# EAGLE design PWB, A2530 BOOSTERPACK (EAGLE 6.2)

## Sheet 1 of 2
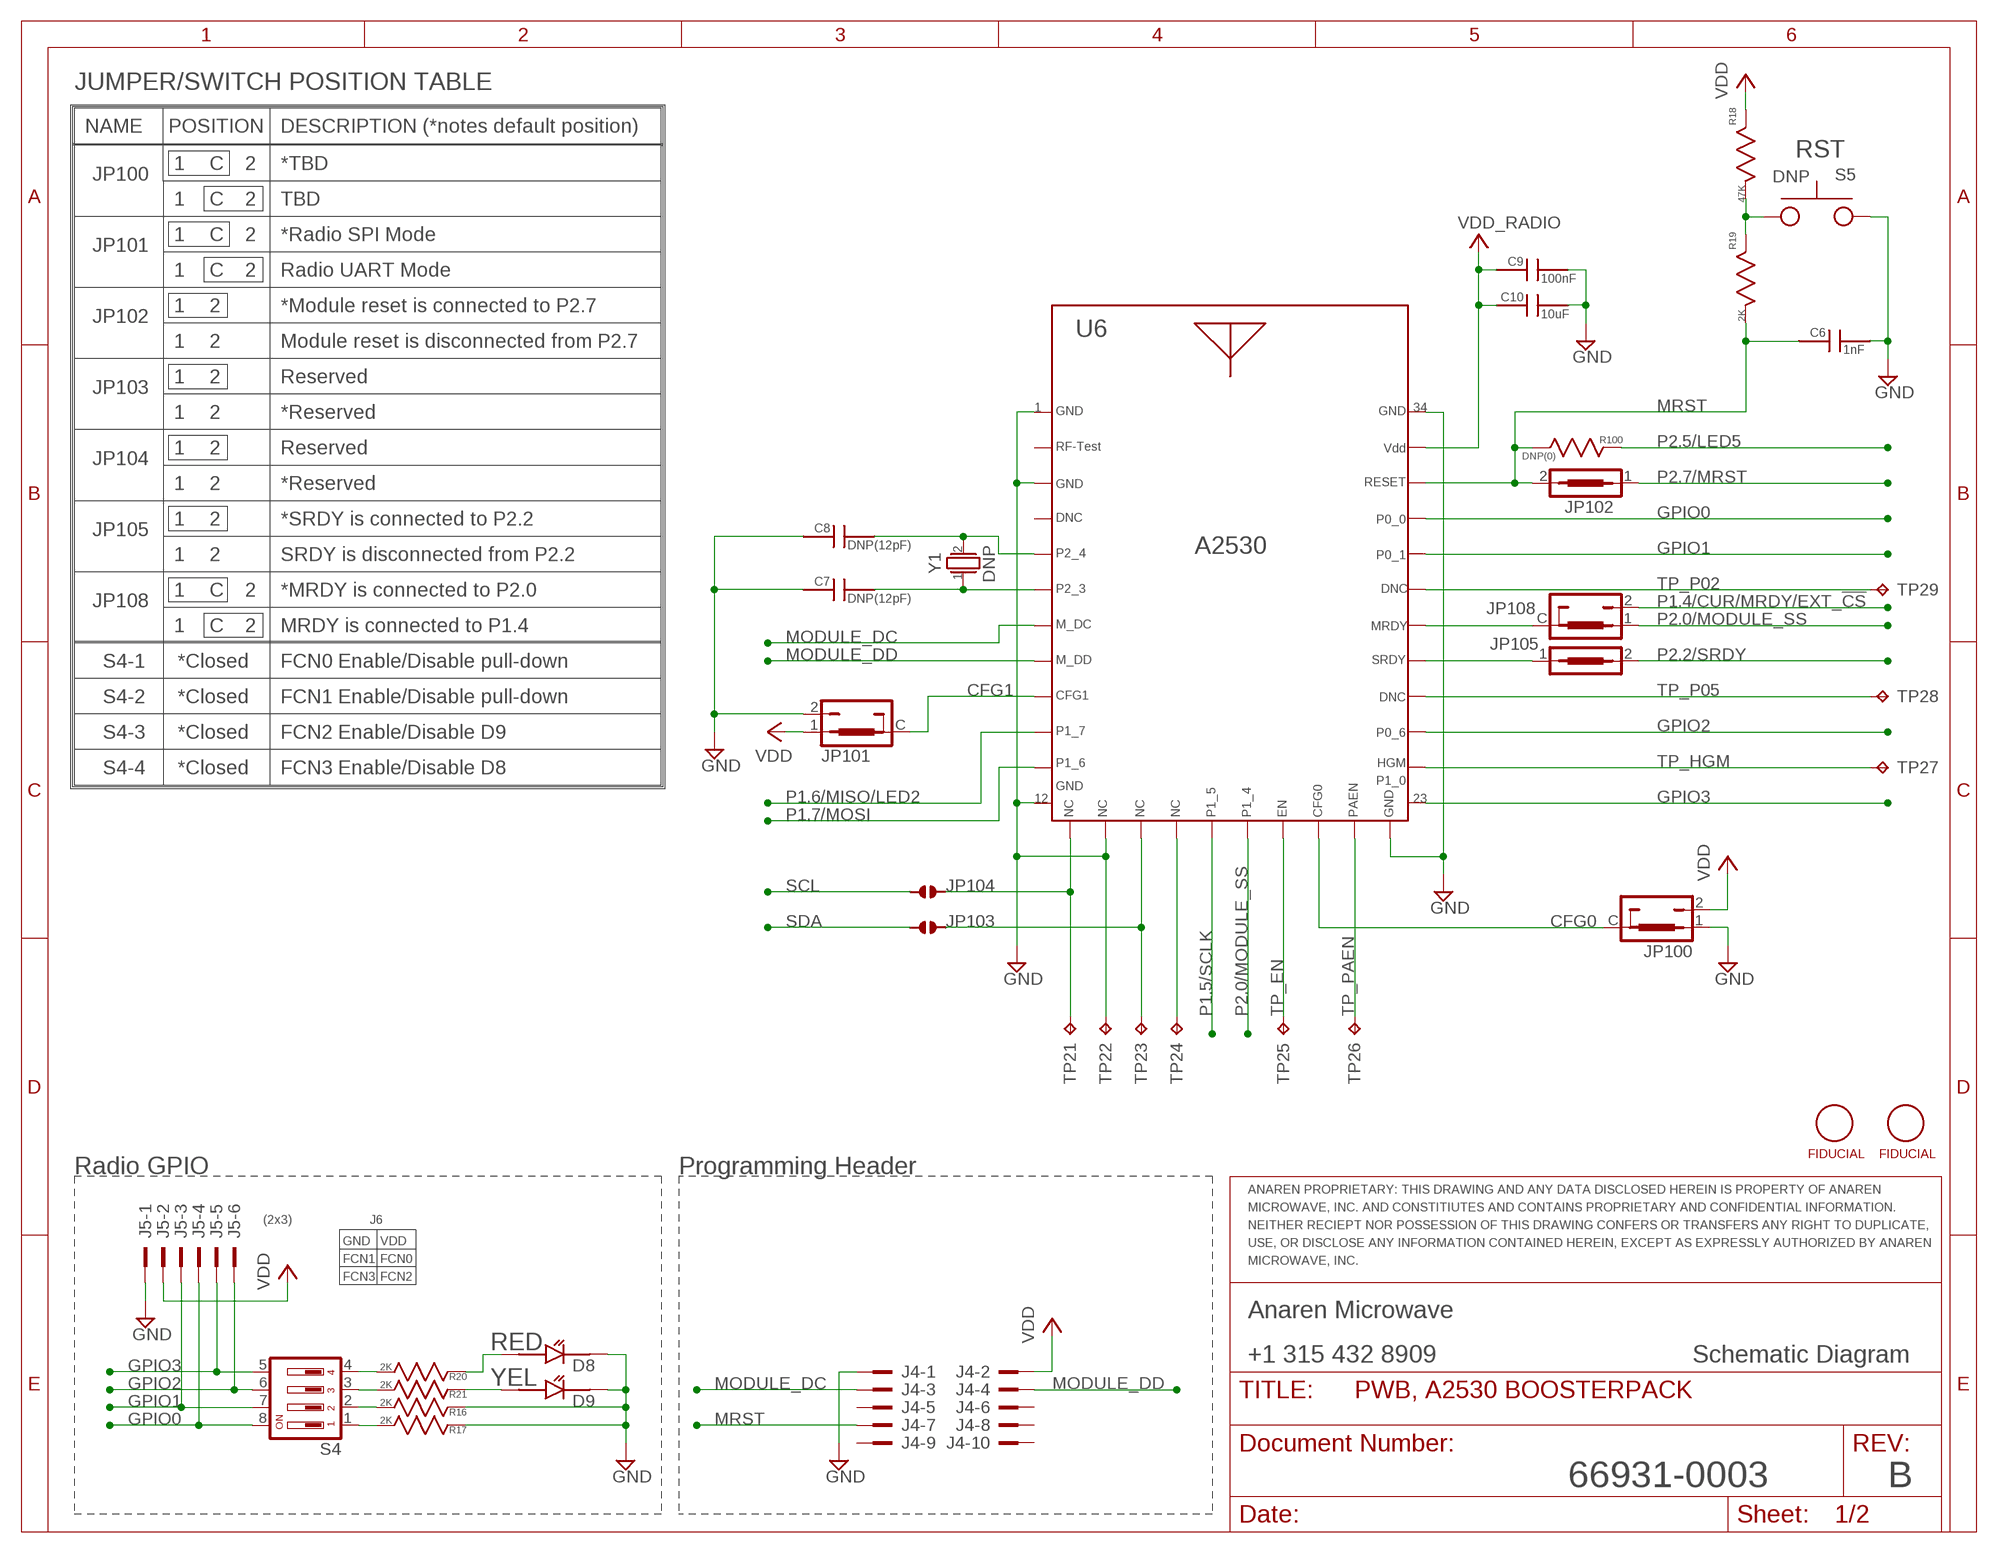
[diagram p0: schematic, sheet 1]

### Parts
C6  1nF  CAP_SMT0402  [0402CAP]
C7  DNP(12pF)  CAP_SMT0402  [0402CAP]
C8  DNP(12pF)  CAP_SMT0402  [0402CAP]
C9  100nF  CAP_SMT0402  [0402CAP]
C10  10uF  CAP_SMT0402  [0402CAP]
D8  LED_SMT_0402  [0402_LED]
D9  LED_SMT_0402  [0402_LED]
J4  SAMTEC_SHF-105-01-L-D-TH_NO_SHROUD  [SAMTEC_SHF-105-01-L-D-TH_NO_SHROUD]
J5  PROTO_100MIL_2X3  [PROTO_100MIL_2X3]
JP100  JP0603_2C_A  [JP0603_2C_A]
JP101  JP0603_2C_A  [JP0603_2C_A]
JP102  JP0603_1P_A  [JP0603_1P_A]
JP103  SOLDER_JUMPER_16MIL  [SOLDER_JUMP_16MIL]
JP104  SOLDER_JUMPER_16MIL  [SOLDER_JUMP_16MIL]
JP105  JP0603_1P_A  [JP0603_1P_A]
JP108  JP0603_2C_A  [JP0603_2C_A]
R16  2K  R0402  [RESC1005X40N]
R17  2K  R0402  [RESC1005X40N]
R18  47K  R0402  [RESC1005X40N]
R19  2K  R0402  [RESC1005X40N]
R20  2K  R0402  [RESC1005X40N]
R21  2K  R0402  [RESC1005X40N]
R100  DNP(0)  0603RES  [0603_COMPONENT]
S4  DIP_SWITCH_218-4LPSTJ  [DIP_SWITCH_218-4LPSTJ]
S5  DNP  SWITCH_B3U-1000P  [SWITCH_B3U-1000P]
TP21  TP_TH_20MIL_R  [TP_TH_20MIL_R]
TP22  TP_TH_20MIL_R  [TP_TH_20MIL_R]
TP23  TP_TH_20MIL_R  [TP_TH_20MIL_R]
TP24  TP_TH_20MIL_R  [TP_TH_20MIL_R]
TP25  TP_TH_20MIL_R  [TP_TH_20MIL_R]
TP26  TP_TH_20MIL_R  [TP_TH_20MIL_R]
TP27  TP_TH_20MIL_R  [TP_TH_20MIL_R]
TP28  TP_TH_20MIL_R  [TP_TH_20MIL_R]
TP29  TP_TH_20MIL_R  [TP_TH_20MIL_R]
U6  CC2530  [CC2530]
U$1  FIDUCIAL0.5MM  [FIDUCIAL_0.5MM]
U$13  FIDUCIAL0.5MM  [FIDUCIAL_0.5MM]
Y1  DNP  ABRACON_ABS06  [ABRACON_ABS06]

### Nets
CFG0: JP100.C U6.20_GIO2
CFG1: JP101.C U6.9_GIO13
GND [GND]: C6.P$2 C7.P$1 C8.P$1 C9.P$2 C10.P$2 D8.2 D9.2 J4.1 J5.1 JP100.1 JP101.2 R16.1 R17.1 S5.2 TP22.P$1(TP) U6.1_GND U6.3_GND U6.12_GND U6.14_USBP U6.22_GND U6.34_GND ; also sheet 2
GPIO0: J5.4 S4.8 U6.31_HGM
GPIO1: J5.3 S4.7 U6.30_GND
GPIO2: J5.6 S4.6 U6.25_BCLK
GPIO3: J5.5 S4.5 U6.23_RSTN
MODULE_DC: J4.3 U6.7_SDA
MODULE_DD: J4.4 U6.8_GIO12
MRDY: JP108.C U6.28_AD1
MRST: C6.P$1 J4.7 JP102.2 R19.2 R100.1 U6.32_IOVDD ; also sheet 2
N$1: R20.2 S4.4
N$2: R21.2 S4.3
N$3: R16.2 S4.2
N$4: R17.2 S4.1
N$5: C7.P$2 U6.6_SCL Y1.1
N$14: D9.1 R21.1
N$15: D8.1 R20.1
N$16: JP104.P2 TP21.P$1(TP) U6.13_USBM
N$17: JP103.P2 TP23.P$1(TP) U6.15_CSN
N$18: R18.2 R19.1 S5.1
N$40: TP24.P$1(TP) U6.16_SCLK
P1.4/CUR/MRDY/EXT_!CS: JP108.2 ; also sheet 2
P1.5/SCLK: U6.17_MOSI ; also sheet 2
P1.6/MISO/LED2: U6.10_PA ; also sheet 2
P1.6/MISO/SCL/LED1: C8.P$2 U6.5_VBAT Y1.2
P1.7/MOSI: U6.11_LNA ; also sheet 2
P2.0/MODULE_SS: JP108.1 U6.18_MISO ; also sheet 2
P2.2/SRDY: JP105.2 ; also sheet 2
P2.5/LED5: R100.2 ; also sheet 2
P2.7/MRST: JP102.1 ; also sheet 2
SCL: JP104.P1 ; also sheet 2
SDA: JP103.P1 ; also sheet 2
SRDY: JP105.1 U6.27_AD0 ; also sheet 2
TP_EN: TP25.P$1(TP) U6.19_GIO1
TP_HGM: TP27.P$1(TP) U6.24_MCLK
TP_P02: TP29.P$1(TP) U6.29_GIO9/AD2
TP_P05: TP28.P$1(TP) U6.26_WCLK
TP_PAEN: TP26.P$1(TP) U6.21_GIO3
VDD [PWR]: J4.2 J5.2 JP100.2 JP101.1 R18.1 ; also sheet 2
VDD_RADIO: C9.P$1 C10.P$1 U6.33_VDD ; also sheet 2
Unconnected: J4.5 J4.6 J4.8 J4.9 J4.10 U6.2_RF_TEST U6.4_DNC

### Notes on the sheet
- JUMPER/SWITCH POSITION TABLE
- NAME | POSITION | DESCRIPTION (*notes default position)
- RST
- 1 | C | 2 | *TBD
- JP100
- 1 | C | 2 | TBD
- 1 | C | 2 | *Radio SPI Mode
- JP101
- 1 | C | 2 | Radio UART Mode
- 1 | 2 | *Module reset is connected to P2.7
- JP102
- 1 | 2 | Module reset is disconnected from P2.7
- 1 | 2 | Reserved
- JP103
- 1 | 34
- 1 | 2 | *Reserved
- 1 | 2 | Reserved
- JP104
- 1 | 2 | *Reserved
- 1 | 2 | *SRDY is connected to P2.2
- JP105
- A2530
- 1 | 2 | SRDY is disconnected from P2.2
- 1 | C | 2 | *MRDY is connected to P2.0
- JP108
- 1 | C | 2 | MRDY is connected to P1.4
- S4-1 | *Closed | FCN0 Enable/Disable pull-down
- S4-2 | *Closed | FCN1 Enable/Disable pull-down
- S4-3 | *Closed | FCN2 Enable/Disable D9
- S4-4 | *Closed | FCN3 Enable/Disable D8
- 12 | 23
- Radio GPIO | Programming Header
- ANAREN PROPRIETARY: THIS DRAWING AND ANY DATA DISCLOSED HEREIN IS PROPERTY OF ANAREN
- MICROWAVE, INC. AND CONSTITIUTES AND CONTAINS PROPRIETARY AND CONFIDENTIAL INFORMATION.
- (2x3) | J6
- NEITHER RECIEPT NOR POSSESSION OF THIS DRAWING CONFERS OR TRANSFERS ANY RIGHT TO DUPLICATE,
- GND | VDD | USE, OR DISCLOSE ANY INFORMATION CONTAINED HEREIN, EXCEPT AS EXPRESSLY AUTHORIZED BY ANAREN
- FCN1 | FCN0 | MICROWAVE, INC.
- FCN3 | FCN2
- Anaren Microwave
- RED
- +1 315 432 8909 | Schematic Diagram
- YEL
- 66931-0003 | B

## Sheet 2 of 2
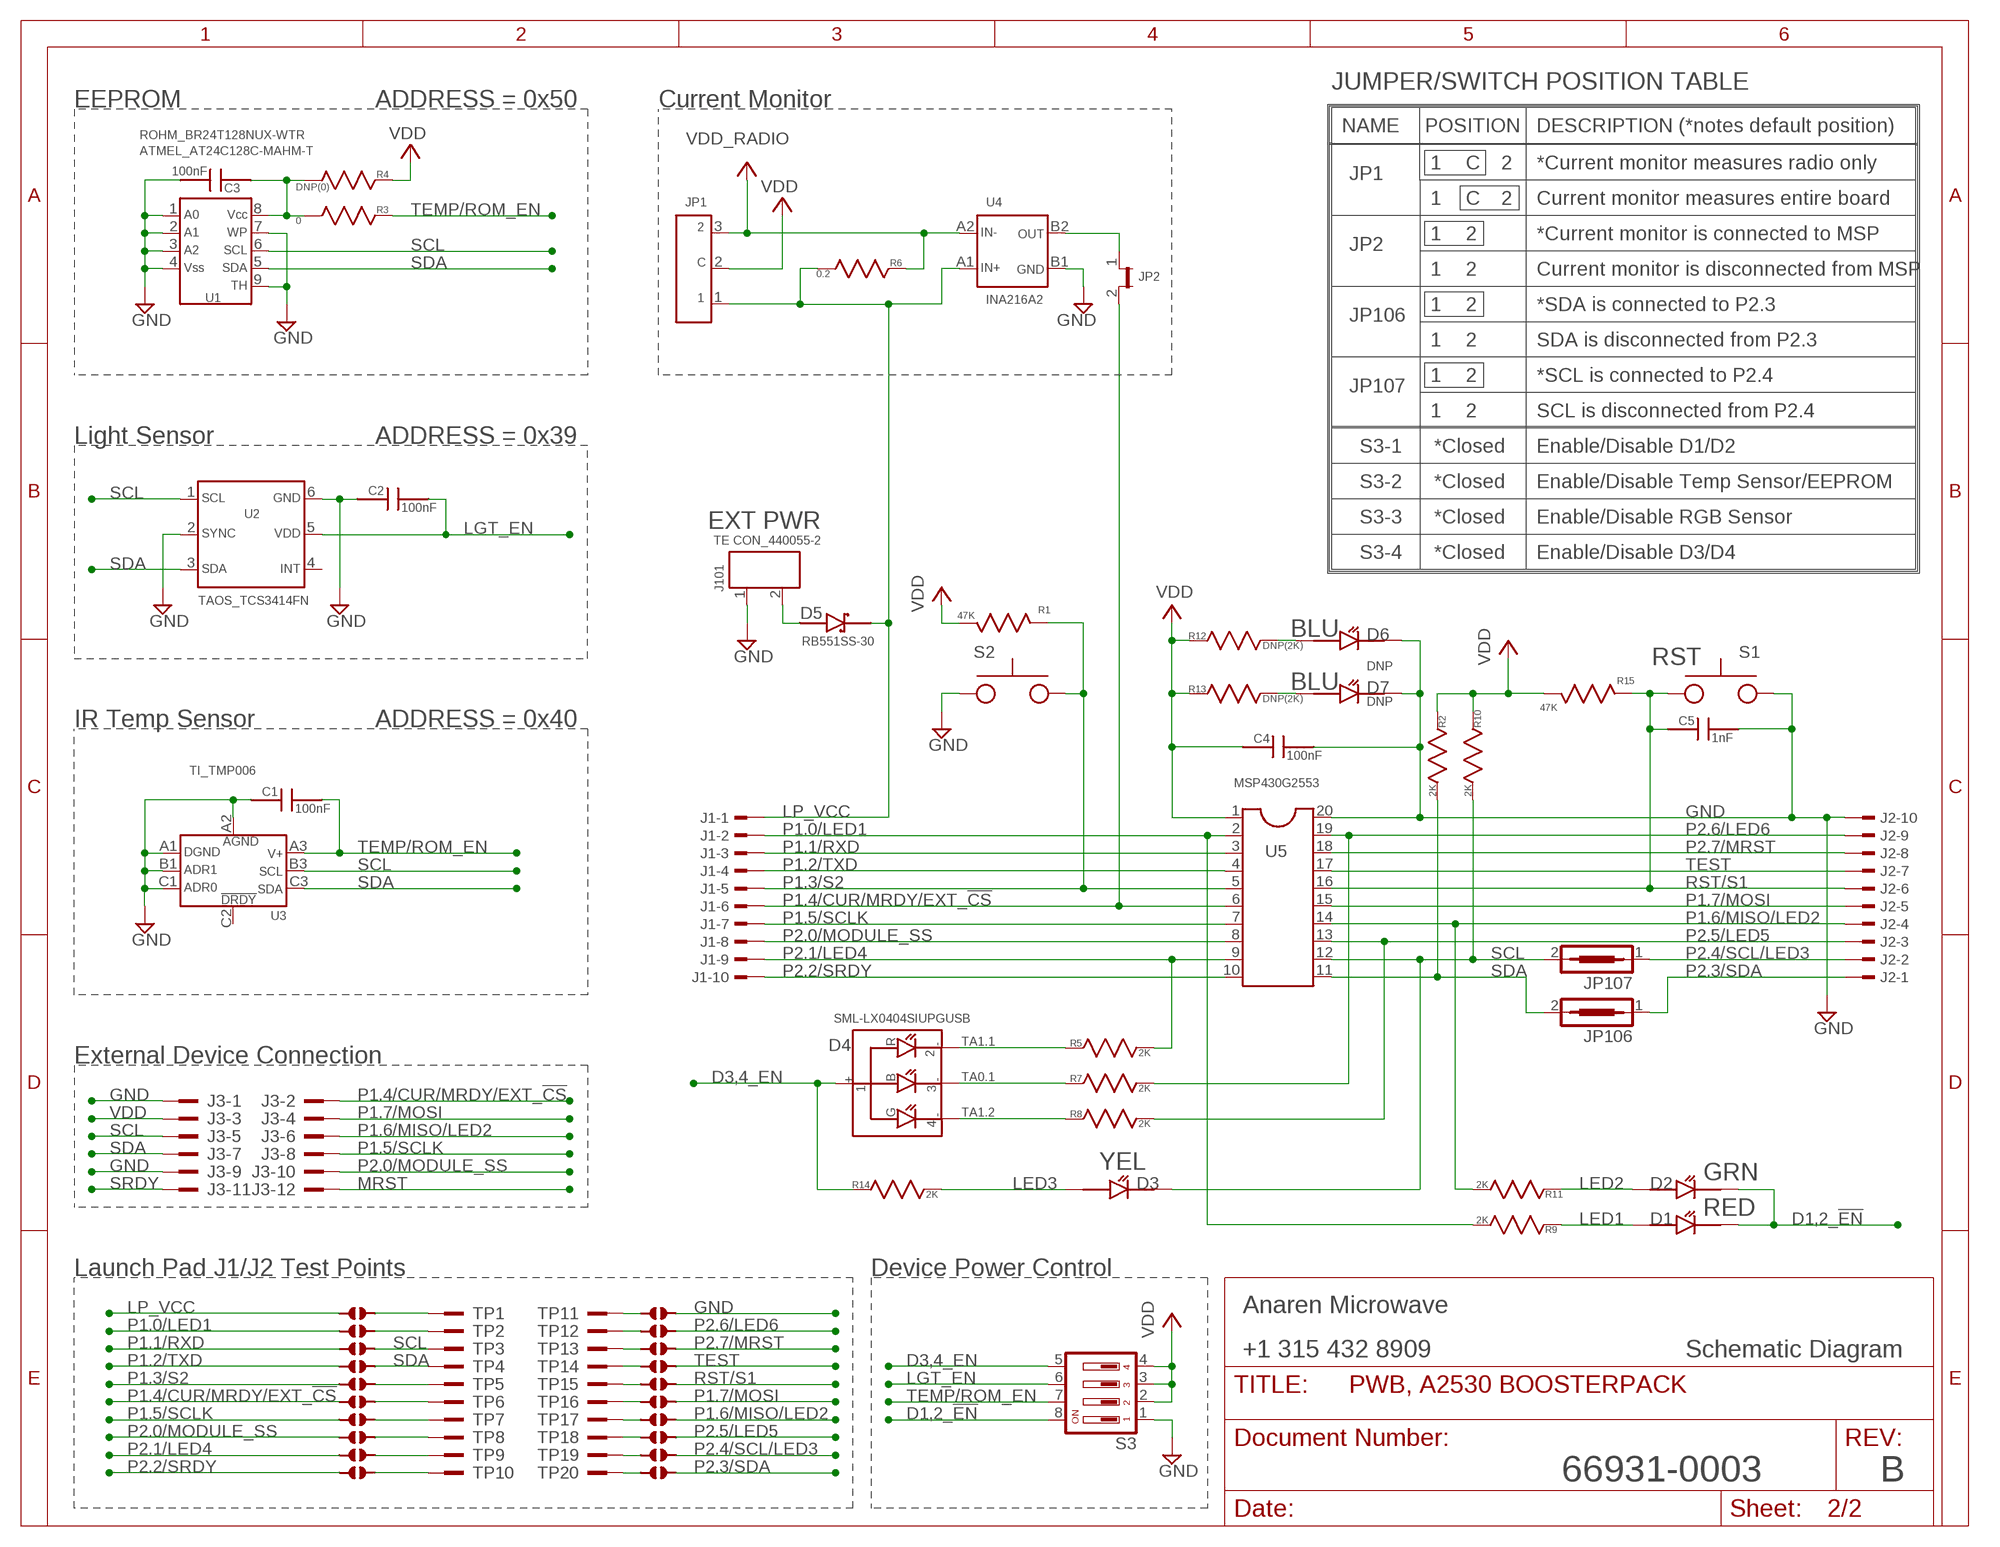
[diagram p1: schematic, sheet 2]

### Parts
C1  100nF  CAP_SMT0402  [0402CAP]
C2  100nF  CAP_SMT0402  [0402CAP]
C3  100nF  CAP_SMT0402  [0402CAP]
C4  100nF  CAP_SMT0402  [0402CAP]
C5  1nF  CAP_SMT0402  [0402CAP]
D1  LED_SMT_0402  [0402_LED]
D2  LED_SMT_0402  [0402_LED]
D3  LED_SMT_0402  [0402_LED]
D4  SML-LX0404SIUPGUSB  [SML-LXO404SIUPGUSB]
D5  RB551SS-30  [1608_DIODE]
D6  LED_SMT_0402  [0402_LED]
D7  LED_SMT_0402  [0402_LED]
J1  TSW-110-02-S-S  [TSW-110-02-S-S]
J2  TSW-110-02-S-S  [TSW-110-02-S-S]
J3  PROTO_100MIL_2X6  [PROTO_100MIL_2X6]
J101  TE_CONNECTIVITY_HEADER_2POS_2MM_RIGHT_ANGLE_T/H  [TE_CONNECTIVITY_HEADER_2POS_2MM_RIGHT_ANGLE_TH]
JP1  SAMTEC_TMM-103-XX-X-S  [SAMTEC_TMM-103-XX-X-S]
JP2  2MM_SHUNT_JUMPER  [SAMTEC_TMM-102-XX-X-S]
JP106  JP0603_1P_A  [JP0603_1P_A]
JP107  JP0603_1P_A  [JP0603_1P_A]
R1  47K  R0402  [RESC1005X40N]
R2  2K  R0402  [RESC1005X40N]
R3  0  R0402  [RESC1005X40N]
R4  DNP(0)  R0402  [RESC1005X40N]
R5  2K  R0402  [RESC1005X40N]
R6  0.2  R0402  [RESC1005X40N]
R7  2K  R0402  [RESC1005X40N]
R8  2K  R0402  [RESC1005X40N]
R9  2K  R0402  [RESC1005X40N]
R10  2K  R0402  [RESC1005X40N]
R11  2K  R0402  [RESC1005X40N]
R12  DNP(2K)  R0402  [RESC1005X40N]
R13  DNP(2K)  R0402  [RESC1005X40N]
R14  2K  R0402  [RESC1005X40N]
R15  47K  R0402  [RESC1005X40N]
S1  SWITCH_B3U-1000P  [SWITCH_B3U-1000P]
S2  SWITCH_B3U-1000P  [SWITCH_B3U-1000P]
S3  DIP_SWITCH_218-4LPSTJ  [DIP_SWITCH_218-4LPSTJ]
TP1  PROTO  [PROTO]
TP2  PROTO  [PROTO]
TP3  PROTO  [PROTO]
TP4  PROTO  [PROTO]
TP5  PROTO  [PROTO]
TP6  PROTO  [PROTO]
TP7  PROTO  [PROTO]
TP8  PROTO  [PROTO]
TP9  PROTO  [PROTO]
TP10  PROTO  [PROTO]
TP11  PROTO  [PROTO]
TP12  PROTO  [PROTO]
TP13  PROTO  [PROTO]
TP14  PROTO  [PROTO]
TP15  PROTO  [PROTO]
TP16  PROTO  [PROTO]
TP17  PROTO  [PROTO]
TP18  PROTO  [PROTO]
TP19  PROTO  [PROTO]
TP20  PROTO  [PROTO]
U1  ROHM_BR24T128NUX-WTR  [UFDFN8_2.0X3.0]
U2  TAOS_TCS3414FN  [TAOS_DFP_3.5X2.3]
U3  TI_TMP006  [BGA-N8]
U4  INA216A2  [WCSP-4]
U5  DIL20  [DIL20]
U$2  SOLDER_JUMPER_16MIL  [SOLDER_JUMP_16MIL]
U$3  SOLDER_JUMPER_16MIL  [SOLDER_JUMP_16MIL]
U$4  SOLDER_JUMPER_16MIL  [SOLDER_JUMP_16MIL]
U$5  SOLDER_JUMPER_16MIL  [SOLDER_JUMP_16MIL]
U$6  SOLDER_JUMPER_16MIL  [SOLDER_JUMP_16MIL]
U$7  SOLDER_JUMPER_16MIL  [SOLDER_JUMP_16MIL]
U$8  SOLDER_JUMPER_16MIL  [SOLDER_JUMP_16MIL]
U$9  SOLDER_JUMPER_16MIL  [SOLDER_JUMP_16MIL]
U$10  SOLDER_JUMPER_16MIL  [SOLDER_JUMP_16MIL]
U$11  SOLDER_JUMPER_16MIL  [SOLDER_JUMP_16MIL]
U$14  SOLDER_JUMPER_16MIL  [SOLDER_JUMP_16MIL]
U$15  SOLDER_JUMPER_16MIL  [SOLDER_JUMP_16MIL]
U$16  SOLDER_JUMPER_16MIL  [SOLDER_JUMP_16MIL]
U$17  SOLDER_JUMPER_16MIL  [SOLDER_JUMP_16MIL]
U$18  SOLDER_JUMPER_16MIL  [SOLDER_JUMP_16MIL]
U$19  SOLDER_JUMPER_16MIL  [SOLDER_JUMP_16MIL]
U$20  SOLDER_JUMPER_16MIL  [SOLDER_JUMP_16MIL]
U$21  SOLDER_JUMPER_16MIL  [SOLDER_JUMP_16MIL]
U$22  SOLDER_JUMPER_16MIL  [SOLDER_JUMP_16MIL]
U$23  SOLDER_JUMPER_16MIL  [SOLDER_JUMP_16MIL]

### Nets
CURRENT: JP2.1 U4.B2
D1,2_!EN [GND]: D1.2 D2.2 S3.8
D3,4_EN: D4.1(+) R14.1 S3.5
GND [GND]: C1.P$1 C2.P$1 C3.P$2 C4.P$2 C5.P$2 D6.2 D7.2 J2.10 J3.1 J3.9 J101.1 S1.2 S2.2 S3.1 U1.1 U1.2 U1.3 U1.4 U1.7 U1.9 U2.2 U2.6 U3.A1 U3.A2 U3.B1 U3.C1 U4.B1 U5.20 U$14.P2 ; also sheet 1
LED1: D1.1 R9.1
LED2: D2.1 R11.1
LED3: D3.1 R14.2
LED4: D4.2(-R) R5.1
LED5: D4.4(-G) R8.1
LED6: D4.3(-B) R7.1
LGT_EN [PWR]: C2.P$2 S3.6 U2.5
LP_VCC [PWR]: D5.P$2 J1.1 JP1.1 R6.2 U4.A1 U$2.P1
MRST: J3.12 ; also sheet 1
N$6: D6.1 R12.2
N$7: D7.1 R13.2
N$11: C3.P$1 R3.2 R4.2 U1.8
N$19 [PWR]: TP1.1(KL) U$2.P2
N$24: TP5.1(KL) U$6.P2
N$25: TP6.1(KL) U$7.P2
N$26: TP7.1(KL) U$8.P2
N$27: TP8.1(KL) U$9.P2
N$28: TP9.1(KL) U$10.P2
N$29: TP10.1(KL) U$11.P2
N$30 [GND]: TP11.1(KL) U$14.P1
N$31: TP12.1(KL) U$15.P1
N$32: TP13.1(KL) U$16.P1
N$33: TP14.1(KL) U$17.P1
N$34: TP15.1(KL) U$18.P1
N$35: TP16.1(KL) U$19.P1
N$36: TP17.1(KL) U$20.P1
N$37: TP18.1(KL) U$21.P1
N$38: TP19.1(KL) U$22.P1
N$39: TP20.1(KL) U$23.P1
N$42 [PWR]: D5.P$1 J101.2
P1.0/LED1: J1.2 R9.2 U5.2 U$3.P1
P1.1/RXD: J1.3 U5.3 U$4.P1
P1.2/TXD: J1.4 U5.4 U$5.P1
P1.3/S2: J1.5 R1.1 S2.1 U5.5 U$6.P1
P1.4/CUR/MRDY/EXT_!CS: J1.6 J3.2 JP2.2 U5.6 U$7.P1 ; also sheet 1
P1.5/SCLK: J1.7 J3.8 U5.7 U$8.P1 ; also sheet 1
P1.6/MISO/LED2: J2.4 J3.6 R11.2 U5.14 U$20.P2 ; also sheet 1
P1.7/MOSI: J2.5 J3.4 U5.15 U$19.P2 ; also sheet 1
P2.0/MODULE_SS: J1.8 J3.10 U5.8 U$9.P1 ; also sheet 1
P2.1/LED4: J1.9 R5.2 U5.9 U$10.P1
P2.2/SRDY: J1.10 U5.10 U$11.P1 ; also sheet 1
P2.3/SDA: J2.1 JP106.1 U$23.P2
P2.4/SCL/LED3: J2.2 JP107.1 U$22.P2
P2.5/LED5: J2.3 R8.2 U5.13 U$21.P2 ; also sheet 1
P2.6/LED6: J2.9 R7.2 U5.19 U$15.P2
P2.7/MRST: J2.8 U5.18 U$16.P2 ; also sheet 1
RST/S1: C5.P$1 J2.6 R15.1 S1.1 U5.16 U$18.P2
SCL: D3.2 J3.5 JP107.2 R10.2 TP3.1(KL) U1.6 U2.1 U3.B3 U5.12 U$4.P2 ; also sheet 1
SDA: J3.7 JP106.2 R2.2 TP4.1(KL) U1.5 U2.3 U3.C3 U5.11 U$5.P2 ; also sheet 1
SRDY: J3.11 ; also sheet 1
STLRS_GND [PWR]: TP2.1(KL) U$3.P2
TEMP/ROM_EN [PWR]: C1.P$2 R3.1 S3.7 U3.A3
TEST: J2.7 U5.17 U$17.P2
VDD [PWR]: C4.P$1 J3.3 JP1.2 R1.2 R2.1 R4.1 R10.1 R12.1 R13.1 R15.2 S3.2 S3.3 S3.4 U5.1 ; also sheet 1
VDD_RADIO: JP1.3 R6.1 U4.A2 ; also sheet 1
Unconnected: U2.4 U3.C2

### Notes on the sheet
- JUMPER/SWITCH POSITION TABLE
- EEPROM | ADDRESS = 0x50 | Current Monitor
- NAME | POSITION | DESCRIPTION (*notes default position)
- ATMEL_AT24C128C-MAHM-T
- 1 | C | 2 | *Current monitor measures radio only
- JP1
- 1 | C | 2 | Current monitor measures entire board
- 2
- 1 | 2 | *Current monitor is connected to MSP
- JP2
- C
- 1 | 2 | Current monitor is disconnected from MSP
- 1
- 1 | 2 | *SDA is connected to P2.3
- JP106
- 1 | 2 | SDA is disconnected from P2.3
- 1 | 2 | *SCL is connected to P2.4
- JP107
- 1 | 2 | SCL is disconnected from P2.4
- Light Sensor | ADDRESS = 0x39
- S3-1 | *Closed | Enable/Disable D1/D2
- S3-2 | *Closed | Enable/Disable Temp Sensor/EEPROM
- EXT PWR | S3-3 | *Closed | Enable/Disable RGB Sensor
- TE CON_440055-2
- S3-4 | *Closed | Enable/Disable D3/D4
- BLU
- RST
- DNP
- BLU
- DNP
- IR Temp Sensor | ADDRESS = 0x40
- MSP430G2553
- TA1.1
- External Device Connection
- TA0.1
- TA1.2
- YEL
- GRN
- RED
- Launch Pad J1/J2 Test Points | Device Power Control
- Anaren Microwave
- +1 315 432 8909 | Schematic Diagram
- 66931-0003 | B

## Library data of the parts
C1-C10 = Anaren_2:CAP_SMT
D1-D3 D6-D9 = Anaren_2:LED_SMT_0402
D4 = Anaren_2:SML-LX0404SIUPGUSB
D5 = Anaren_2:RB551SS-30
J1 J2 = con-samtec:TSW-110-02-S-S: THROUGH-HOLE .025" SQ POST HEADER Source: Samtec TSW.pdf; OC_FARNELL: unknown; OC_NEWARK: unknown
J3 = Anaren_2:PROTO_100MIL_2X6
J4 = Anaren_2:SAMTEC_SHF-105-01-L-D-TH_NO_SHROUD
J5 = Anaren_2:PROTO_100MIL_2X3
J101 = Anaren_2:TE_CONNECTIVITY_HEADER_2POS_2MM_RIGHT_ANGLE_T/H
JP1 = Anaren_2:SAMTEC_TMM-103-XX-X-S
JP2 = Anaren_2:2MM_SHUNT_JUMPER
JP100 JP101 JP108 = Anaren_MGS:JP0603_2C_A
JP102 JP105-JP107 = Anaren_MGS:JP0603_1P_A
JP103 JP104 U$2-U$11 U$14-U$23 = Anaren_2:SOLDER_JUMPER_16MIL
R1-R21 = Anaren_MGS:R0402
R100 = Anaren_2:0603RES
S1 S2 S5 = Anaren_MGS:SWITCH_B3U-1000P: 1.2 X 3.0mm TACT Switch (SMD) Omron
S3 S4 = Anaren_2:DIP_SWITCH_218-4LPSTJ
TP1-TP20 = Anaren_2:PROTO
TP21-TP29 = Anaren_2:TP_TH_20MIL_R
U1 = Anaren_2:ROHM_BR24T128NUX-WTR
U2 = Anaren_2:TAOS_TCS3414FN
U3 = Anaren_2:TI_TMP006
U4 = Anaren_2:INA216A2
U5 = ic-package:DIL20: Dual In Line / Socket
U6 = Anaren_2:CC2530
U$1 U$13 = Anaren_MGS:FIDUCIAL
Y1 = Anaren_2:ABRACON_ABS06

## Net classes
0 default: clearance 0.127 mm
1 GND: clearance 0.203 mm
2 RF: width 0.516 mm, clearance 0.635 mm
3 PWR: clearance 0.203 mm

## Board
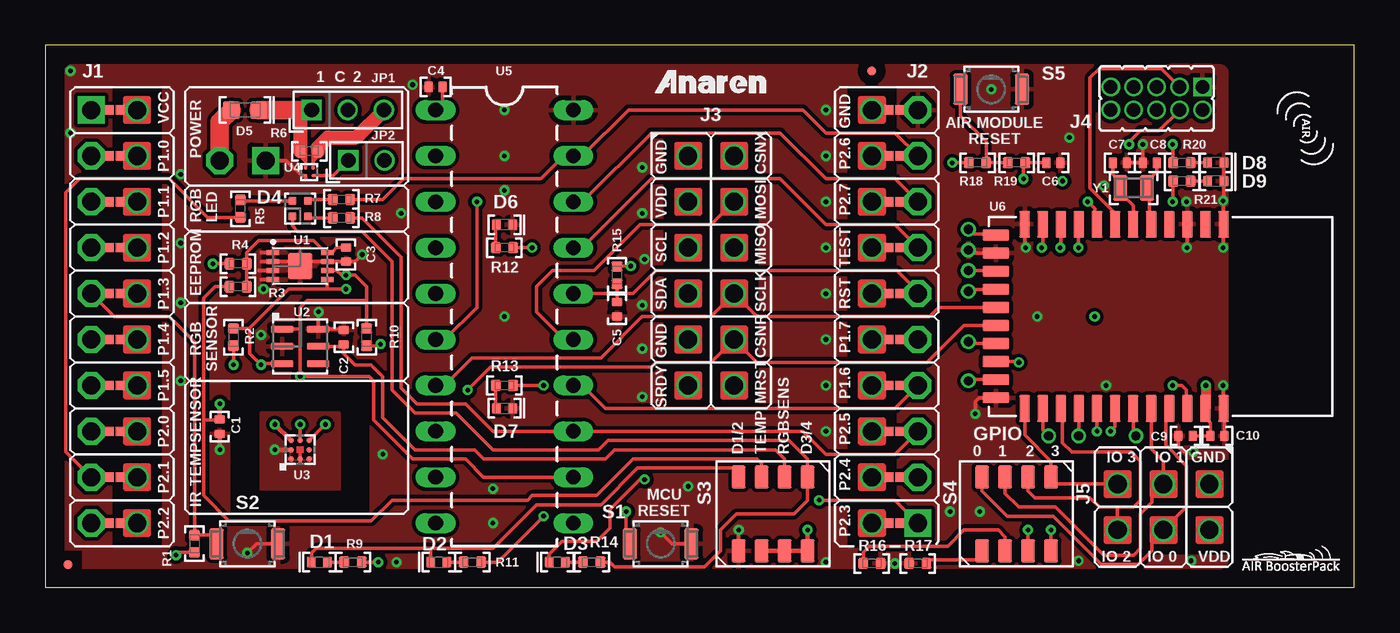
[diagram p2: board, top side]
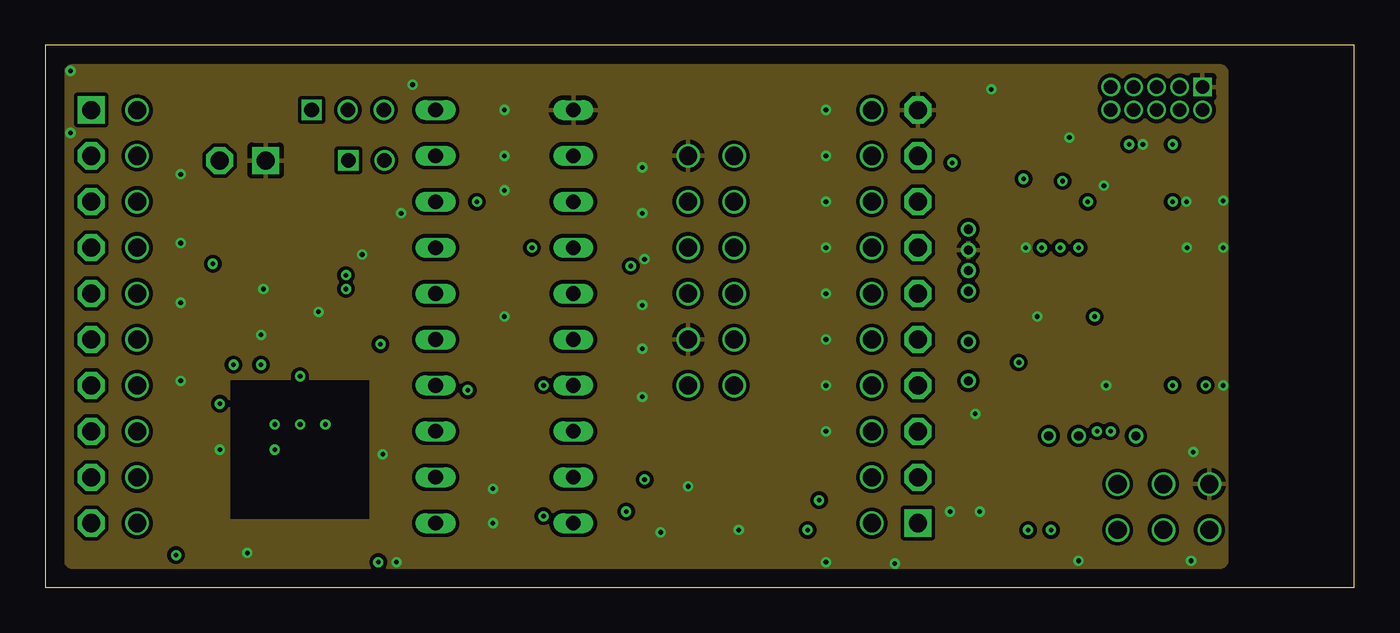
[diagram p3: board, inner layer L2_GND]
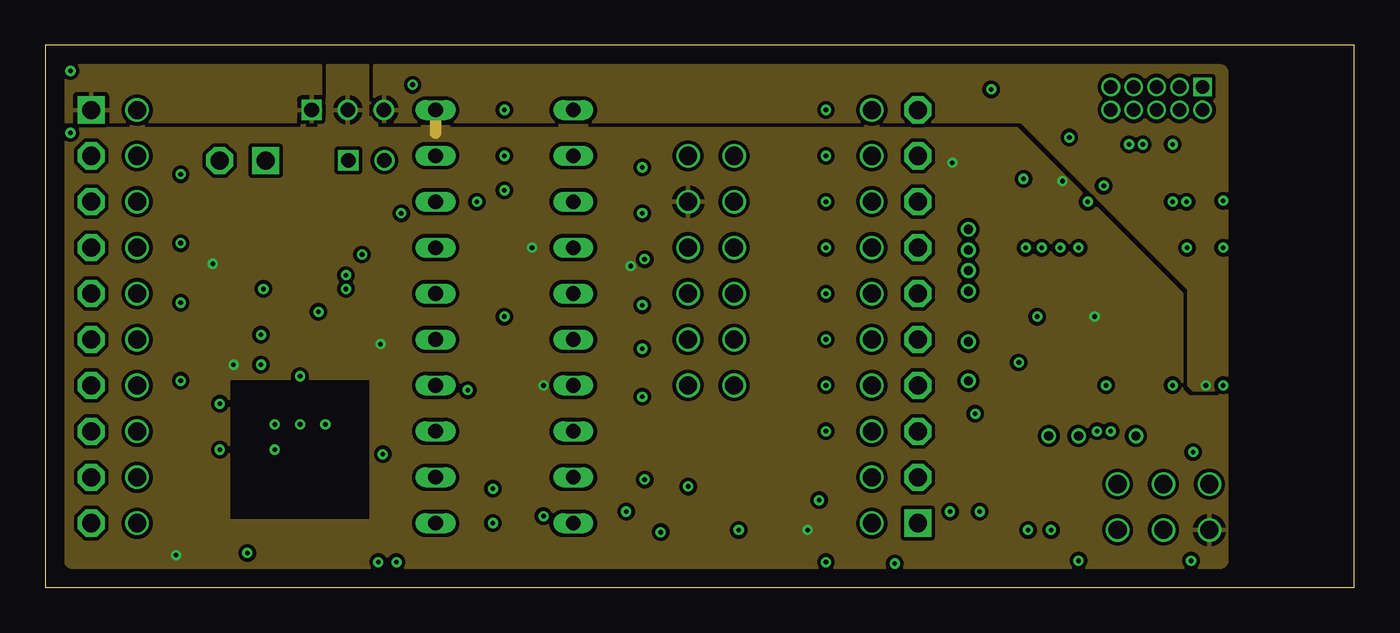
[diagram p4: board, inner layer L3_PWR]
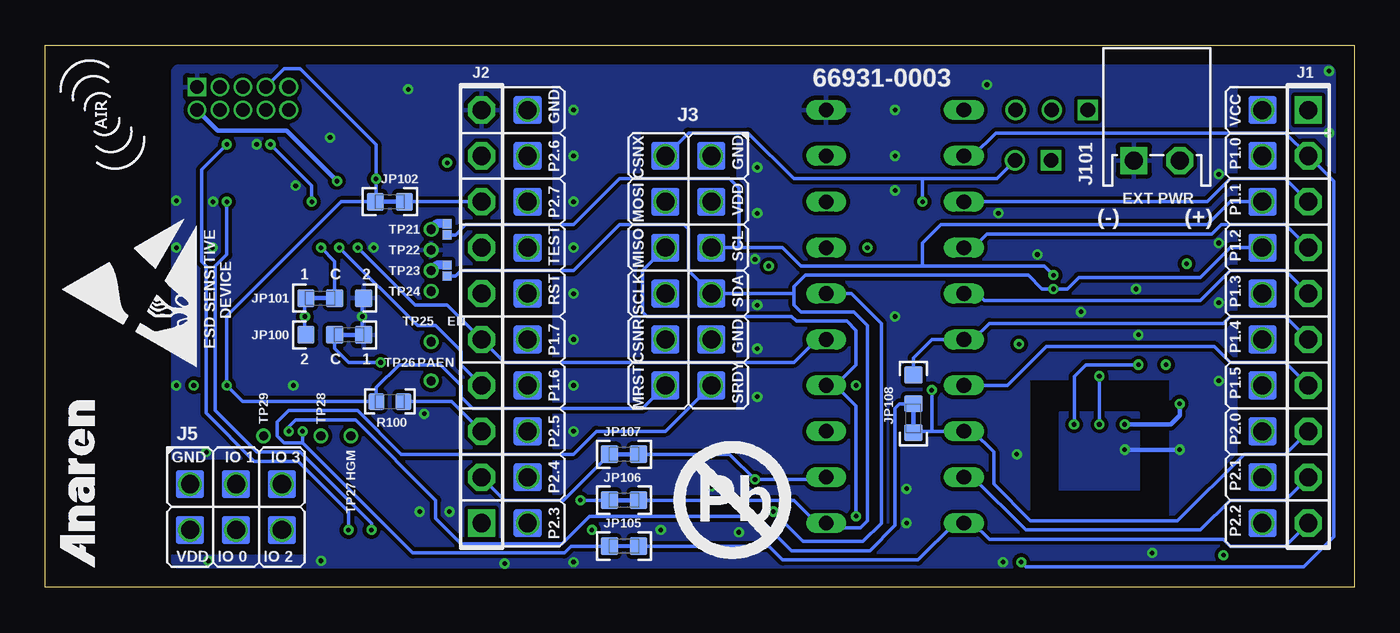
[diagram p5: board, bottom side, seen from below]

Size 72.4 x 30 mm. Coordinates in mm from the lower left corner, seen from the top.
Outline: 0,0 72.4,0 72.4,30 0,30 0,0
Copper layers ((1*2)+(15*16)): Top 0.0175mm / dielectric 5mil / L2_GND 0.0175mm / dielectric 50mil / L3_PWR 0.0175mm / dielectric 5mil / Bottom 0.0175mm
Design rules: minimum track width 5mil, minimum drill 10mil, track to track 8mil, track to pad 8mil, pad to pad 8mil, via to via 8mil, smd to smd 0.1mm, copper to edge 40mil, drill to drill 8mil, minimum pad ring 6mil, minimum via ring 6mil, stop-mask expansion 4mil, vias tented up to drill 10mil, thermal gap 10mil
tRestrict: area 0.5,0.5 to 2,2; area 13.6,7.1 to 14.6,8.1; area 65.5,0.5 to 71.9,29.5
bRestrict: area 65.5,0.5 to 71.9,29.5

### Footprints (pad centres in the part's own frame; a part is rotated, then mirrored left to right if it is on the bottom)
0402CAP = smd 0.483 x 0.61: P$1 -0.394,0; P$2 0.394,0
0402_LED = smd 0.5 x 0.6: 1 -0.45,0; 2 0.45,0
SML-LXO404SIUPGUSB = smd 0.45 x 0.45: 1(+) 0.425,0.425; 2(-R) 0.425,-0.425; 3(-B) -0.425,-0.425; 4(-G) -0.425,0.425
1608_DIODE = smd 0.9 x 0.95: P$1 -0.75,0; P$2 0.75,0
TSW-110-02-S-S = drill 1 pad 1.5 square: 1 11.43,0 | drill 1 pad 1.5 octagon: 2 8.89,0; 3 6.35,0; 4 3.81,0; 5 1.27,0; 6 -1.27,0; 7 -3.81,0; 8 -6.35,0; 9 -8.89,0; 10 -11.43,0
PROTO_100MIL_2X6 = drill 1: 1 0,0; 2 2.54,0; 3 0,-2.54; 4 2.54,-2.54; 5 0,-5.08; 6 2.54,-5.08; 7 0,-7.62; 8 2.54,-7.62; 9 0,-10.16; 10 2.54,-10.16; 11 0,-12.7; 12 2.54,-12.7
SAMTEC_SHF-105-01-L-D-TH_NO_SHROUD = drill 0.737 pad 1.041 square: 1 -2.54,-0.635 | drill 0.737 pad 1.041: 2 -2.54,0.635; 3 -1.27,-0.635; 4 -1.27,0.635; 5 0,-0.635; 6 0,0.635; 8 1.27,0.635; 9 2.54,-0.635; 10 2.54,0.635 | drill 0.737 pad 0.991: 7 1.27,-0.635
PROTO_100MIL_2X3 = drill 1: 1 0,0; 2 2.54,0; 3 0,-2.54; 4 2.54,-2.54; 5 0,-5.08; 6 2.54,-5.08
TE_CONNECTIVITY_HEADER_2POS_2MM_RIGHT_ANGLE_TH = drill 1 pad 1.5 square: 1 -1.27,0 | drill 1 pad 1.5 octagon: 2 1.27,0
SAMTEC_TMM-103-XX-X-S = drill 0.813 square: 1 0,0 | drill 0.813: 2 2,0; 3 4,0
SAMTEC_TMM-102-XX-X-S = drill 0.813 square: 1 0,0 | drill 0.813: 2 2,0
JP0603_2C_A = smd 0.95 x 1: 1 -1.6,0; 2 1.6,0; C 0,0
JP0603_1P_A = smd 0.95 x 1: 1 -0.8,0; 2 0.8,0
SOLDER_JUMP_16MIL = smd 0.508 x 0.508: P1 -0.305,0; P2 0.305,0
RESC1005X40N = smd 0.57 x 0.62: 1 -0.48,0; 2 0.48,0
0603_COMPONENT = smd 0.9 x 0.95: 1 -0.75,0; 2 0.75,0
SWITCH_B3U-1000P = smd 0.8 x 1.7: 1 -1.7,0; 2 1.7,0
DIP_SWITCH_218-4LPSTJ = smd 1.27 x 0.762: 1 -2.045,1.905; 2 -2.045,0.635; 3 -2.045,-0.635; 4 -2.045,-1.905; 5 2.045,-1.905; 6 2.045,-0.635; 7 2.045,0.635; 8 2.045,1.905
PROTO = drill 1: 1 0,0
TP_TH_20MIL_R = drill 0.508: P$1 0,0
UFDFN8_2.0X3.0 = smd 0.3 x 0.75: 1 -0.75,-1.5; 2 -0.25,-1.5; 3 0.25,-1.5; 4 0.75,-1.5; 5 0.75,1.5; 6 0.25,1.5; 7 -0.25,1.5; 8 -0.75,1.5 | smd 1.46 x 1.36: 9 0,0
TAOS_DFP_3.5X2.3 = smd 1.25 x 0.4: 1 -1,0.95; 2 -1,0; 3 -1,-0.95; 4 1,-0.95; 5 1,0; 6 1,0.95
BGA-N8 = smd 0.3 x 0.3: A1 -0.5,0.5; A2 0,0.5; A3 0.5,0.5; B1 -0.5,0; B3 0.5,0; C1 -0.5,-0.5; C2 0,-0.5; C3 0.5,-0.5
WCSP-4 = smd 0.2 x 0.2: A1 -0.2,-0.2; A2 -0.2,0.2; B1 0.2,-0.2; B2 0.2,0.2
DIL20 = drill 0.813 long: 1 -11.43,-3.81; 2 -8.89,-3.81; 3 -6.35,-3.81; 4 -3.81,-3.81; 5 -1.27,-3.81; 6 1.27,-3.81; 7 3.81,-3.81; 8 6.35,-3.81; 9 8.89,-3.81; 10 11.43,-3.81; 11 11.43,3.81; 12 8.89,3.81; 13 6.35,3.81; 14 3.81,3.81; 15 1.27,3.81; 16 -1.27,3.81; 17 -3.81,3.81; 18 -6.35,3.81; 19 -8.89,3.81; 20 -11.43,3.81
CC2530 = smd 1.499 x 0.61: 1_GND -0.596,12.591; 2_RF_TEST -0.596,11.591; 3_GND -0.596,10.591; 4_DNC -0.596,9.591; 5_VBAT -0.596,8.591; 6_SCL -0.596,7.591; 7_SDA -0.596,6.591; 8_GIO12 -0.596,5.591; 9_GIO13 -0.596,4.591; 10_PA -0.596,3.591; 11_LNA -0.596,2.591; 12_GND -0.596,1.591; 23_RSTN 9.596,1.591; 24_MCLK 9.596,2.591; 25_BCLK 9.596,3.591; 26_WCLK 9.596,4.591; 27_AD0 9.596,5.591; 28_AD1 9.596,6.591; 29_GIO9/AD2 9.596,7.591; 30_GND 9.596,8.591; 31_HGM 9.596,9.591; 32_IOVDD 9.596,10.591; 33_VDD 9.596,11.591; 34_GND 9.596,12.591 | smd 0.61 x 1.499: 13_USBM 0,0; 14_USBP 1,0; 15_CSN 2,0; 16_SCLK 3,0; 17_MOSI 4,0; 18_MISO 5,0; 19_GIO1 6,0; 20_GIO2 7,0; 21_GIO3 8,0; 22_GND 9,0
FIDUCIAL_0.5MM = smd 0.5 x 0.5: P$1 0,0
ABRACON_ABS06 = smd 0.762 x 1.397: 1 -0.737,0; 2 0.737,0

### Placement (x,y rotation side)
C1  9.65,8.89 90 top
C2  16.51,13.84 270 top
C3  16.64,18.41 270 top
C4  21.59,27.69 180 top
C5  31.62,15.39 270 top
C6  55.75,23.5 0 top
C7  59.44,23.5 180 top
C8  61.09,23.5 0 top
C9  63.07,8.38 180 top
C10  64.82,8.38 0 top
D1  15.16,1.4 180 top
D2  21.77,1.4 180 top
D3  28.32,1.4 180 top
D4  14.1,20.95 180 top
D5  11.05,26.42 0 top
D6  25.4,20.07 0 top
D7  25.4,9.91 0 top
D8  64.74,23.5 0 top
D9  64.74,22.48 0 top
DRILEGEND  [DRILEGEND]  -3.05,-7.35 0 top  (outside the outline)
J1  2.54,14.99 90 bottom
J2  48.26,14.99 270 bottom
J3  35.56,23.88 0 top
J4  61.47,27.05 180 top
J5  64.39,5.71 270 top
J101  10.92,23.62 0 bottom
JP1  14.73,26.42 0 top
JP2  16.76,23.62 0 top
JP100  56.39,13.97 180 bottom
JP101  56.39,16 0 bottom
JP102  53.34,21.34 180 bottom
JP103  50.16,17.53 90 bottom
JP104  50.16,19.81 90 bottom
JP105  40.39,2.29 0 bottom
JP106  40.39,4.83 0 bottom
JP107  40.39,7.37 0 bottom
JP108  24.38,10.16 90 bottom
R1  8.26,2.42 270 top
R2  10.41,13.84 90 top
R3  10.67,16.64 0 top
R4  10.67,17.91 0 top
R5  10.79,20.95 270 top
R6  14.61,24.13 180 top
R7  16.38,21.46 0 top
R8  16.38,20.45 0 top
R9  17.02,1.4 0 top
R10  17.78,13.84 90 top
R11  23.62,1.4 0 top
R12  25.4,18.8 180 top
R13  25.4,11.18 180 top
R14  30.23,1.4 180 top
R15  31.62,17.27 90 top
R16  45.72,1.33 180 top
R17  48.26,1.33 0 top
R18  51.56,23.5 0 top
R19  53.72,23.5 0 top
R20  62.87,23.5 180 top
R21  62.87,22.48 180 top
R100  53.34,10.29 0 bottom
S1  34.04,2.41 0 top
S2  11.18,2.41 0 top
S3  40.26,4.06 90 top
S4  53.72,4.06 90 top
S5  52.32,27.56 0 top
TP1  5.08,26.42 90 top
TP2  5.08,23.88 90 top
TP3  5.08,21.34 90 top
TP4  5.08,18.8 90 top
TP5  5.08,16.26 90 top
TP6  5.08,13.72 90 top
TP7  5.08,11.18 90 top
TP8  5.08,8.64 90 top
TP9  5.08,6.1 90 top
TP10  5.08,3.56 90 top
TP11  45.72,26.42 90 top
TP12  45.72,23.88 90 top
TP13  45.72,21.34 90 top
TP14  45.72,18.8 90 top
TP15  45.72,16.26 90 top
TP16  45.72,13.72 90 top
TP17  45.72,11.18 90 top
TP18  45.72,8.64 90 top
TP19  45.72,6.1 90 top
TP20  45.72,3.56 90 top
TP21  51.05,19.81 0 bottom
TP22  51.05,18.67 0 bottom
TP23  51.05,17.53 0 bottom
TP24  51.05,16.38 0 bottom
TP25  51.05,13.59 0 top
TP26  51.05,11.43 0 top
TP27  55.5,8.38 0 top
TP28  57.15,8.38 0 top
TP29  60.33,8.38 0 top
U1  14.1,17.78 270 top
U2  14.1,13.34 0 top
U3  14.1,7.62 90 top
U4  14.61,22.99 270 top
U5  25.4,14.99 270 top
U6  52.58,19.49 270 top
U$1  1.27,1.27 0 top
U$2  3.84,26.42 0 top
U$3  3.84,23.88 0 top
U$4  3.84,21.34 0 top
U$5  3.84,18.8 0 top
U$6  3.84,16.26 0 top
U$7  3.84,13.72 0 top
U$8  3.84,11.18 0 top
U$9  3.84,8.64 0 top
U$10  3.84,6.1 0 top
U$11  3.84,3.56 0 top
U$12  [ANAREN_LOGO_SCALE_0.2]  33.66,27.3 0 top
U$13  45.72,28.57 0 top
U$14  46.96,26.42 0 top
U$15  46.96,23.88 0 top
U$16  46.96,21.34 0 top
U$17  46.96,18.8 0 top
U$18  46.96,16.26 0 top
U$19  46.96,13.72 0 top
U$20  46.96,11.18 0 top
U$21  46.96,8.64 0 top
U$22  46.96,6.1 0 top
U$23  46.96,3.56 0 top
U$24  [LAUNCHPAD_HALF_ROCKET_SCALE_0.5]  66.04,0.76 0 top
U$25  [AIR_LOGO_SCALE_0.1]  69.72,25.4 270 top
U$100  [ANAREN_LOGO_SCALE_0.3]  69.6,1.02 90 bottom
U$101  [AIR_LOGO_SCALE_0.15]  66.8,23.11 90 bottom
U$102  [ESD_LOGO_SCALE_0.2]  64.01,12.19 90 bottom
U$103  [PB-FREE_LOGO_SCALE_1.0]  34.29,4.83 0 bottom
Y1  60.2,22.1 0 top

### Tracks (layer width: path | path; a pad name or v marks a point on that pad's centre or on a via)
CFG0  (via drill 0.25)
  Top 0.203: U6.20_GIO2 53.8,12.49 v53.85,12.45
  Bottom 0.203: v53.85,12.45 55.63,12.45 56.39,13.21 JP100.C
CFG1  (via drill 0.25)
  Top 0.203: v57.15,18.8 57.15,20.07 U6.9_GIO13
  Bottom 0.203: JP101.C 56.39,18.03 v57.15,18.8
CURRENT
  Top 0.203: U4.B2 15.93,22.79 JP2.1
D1,2_!EN
  Top 0.203: 21.34,2.16 24.77,2.16 27.18,4.57 30.73,4.57 32.77,6.6 38.23,6.6 38.23,6.24 S3.8 | 21.34,2.16 14.99,2.16 14.73,1.91 14.73,1.42 D1.2 | D2.2 21.32,2.14 21.34,2.16
D3,4_EN
  Top 0.203: D4.1(+) 13.67,19.98 13.97,19.68 17.53,19.68 19.18,18.03 19.18,10.92 20.45,9.65 22.73,9.65 24.77,7.62 30.61,7.62 31.11,8.13 41.15,8.13 42.16,7.11 S3.5 42.16,4.83 41.4,4.06 38.23,4.06 37.34,3.17 37.34,2.03 36.45,1.14 31.5,1.14 31.24,1.4 R14.1
GND  (via drill 0.25)
  Top 0.203: 52.7,10.49 U6.22_GND 51.64,10.49 51.44,10.29 v51.44,9.6 | 14.1,7.49 U3.B1 14.1,6.99 | 51.18,18.54 TP22.P$1 51.23,18.49 U6.14_USBP | C7.P$1 C8.P$1 60.71,23.51 v60.71,24.51 | C2.P$1 16.46,14.29 U2.6 15.1,15.22 v15.11,15.24 | S2.2 11.68,2.41 v11.18,1.91 | S1.2 34.67,2.41 v34.04,3.05 | S3.1 v38.35,3.17 | C9.P$2 62.68,7.81 62.99,7.49 v63.49,7.49 | v65.15,11.18 65.17,11.16 U6.34_GND 65.22,9.85 C10.P$2 | v65.15,18.8 65.15,20.07 | 65.15,20.07 U6.1_GND | 65.15,20.07 v65.15,21.4 65.19,21.45 D9.2 D8.2 | U6.3_GND 63.17,18.82 v63.15,18.8 | 16.63,18.03 U1.7 14.35,18.03 U1.9 13.85,18.03 U1.2 11.94,18.03 | 16.63,18.03 C3.P$2 | 16.63,18.03 17.14,18.03 v17.53,18.41 | U6.12_GND 54.17,18.86 v54.23,18.8 | J101.1 13.34,23.62 14.17,22.79 U4.B1 14.4,22.53 | U1.1 11.94,18.53 11.94,18.54 | U1.4 11.94,17.03 11.94,17.02 | U1.3 11.81,17.53
  Top 0.254: U3.A2 v12.7,7.62 | v9.65,7.62 C1.P$1
  Top 0.508: U$14.P2 J2.10
  Bottom 0.203: JP100.1 54.86,14.05 v54.86,14.99 54.86,15.93 JP101.2
  Bottom 0.254: v12.7,7.62 v9.65,7.62
  other vias: 1.4,25.15 1.4,28.57 46.99,1.32 63.12,21.34 58.67,11.18 11.94,13.97 56.64,24.89 25.4,23.88 25.4,26.42 24.77,5.46 24.77,3.56 43.18,26.42 43.18,23.88 43.18,21.34 43.18,18.8 43.18,16.26 43.18,13.72 43.18,11.18 43.18,8.64 43.18,1.4 33.02,23.24 33.02,20.7 33.15,18.16 33.02,15.62 33.02,13.21 25.4,21.97 25.4,14.99 7.49,19.05 7.49,15.75 7.49,11.43 7.49,22.86 19.43,1.4 19.68,20.7 57.15,1.47 18.67,7.37 51.69,4.19 20.32,27.81 52.32,27.56 33.02,10.54 58.55,22.23 35.56,5.59 50.04,4.19 12.06,16.51 63.37,1.47
  pour L2_GND: 10.16,1.12 1.5,1.12 arc-90 1.12,1.5 1.12,28.47 arc-90 1.5,28.85 64.97,28.85 arc-90 65.35,28.47 65.35,1.5 arc-90 64.97,1.12 10.19,1.12 10.19,3.68 18.03,3.68 18.03,11.56 10.16,11.56
  pour Top: 11.94,9.65 16.26,9.65 16.26,5.33 11.94,5.33
  pour Bottom: 11.94,9.65 16.26,9.65 16.26,5.33 11.94,5.33
  pour Top (rank 2): 10.16,1.12 1.5,1.12 arc-90 1.12,1.5 1.12,28.47 arc-90 1.5,28.85 64.97,28.85 arc-90 65.35,28.47 65.35,1.5 arc-90 64.97,1.12 10.19,1.12 10.19,3.68 18.03,3.68 18.03,11.56 10.16,11.56
  pour Bottom (rank 2): 10.16,1.12 1.5,1.12 arc-90 1.12,1.5 1.12,28.47 arc-90 1.5,28.85 64.97,28.85 arc-90 65.35,28.47 65.35,1.5 arc-90 64.97,1.12 10.19,1.12 10.19,3.68 18.03,3.68 18.03,11.56 10.16,11.56
GPIO0
  Top 0.203: U6.31_HGM 62.17,9.46 61.98,9.27 61.98,7.87 63.12,6.73 63.12,4.45 J5.4 61.21,2.54 61.21,2.03 60.45,1.27 58.42,1.27 55.75,3.94 53.21,3.94 51.82,5.33 S4.8
GPIO1
  Top 0.203: S4.7 53.09,5.21 53.85,4.45 55.88,4.45 58.55,1.78 60.2,1.78 60.58,2.16 60.58,4.06 61.21,4.7 61.21,5.08 J5.3 61.85,6.99 61.17,7.67 U6.30_GND
GPIO2
  Top 0.203: U6.25_BCLK 56.17,9.36 56.26,9.27 56.26,8 56.77,7.49 60.07,7.49 60.58,6.99 60.58,4.83 60.2,4.45 59.31,4.45 | S4.6 54.36,5.33 54.74,4.95 57.78,4.95 58.29,4.45 59.31,4.45 | J5.6 59.31,4.45
GPIO3
  Top 0.203: U6.23_RSTN 54.17,8.44 55.63,6.99 S4.5 55.63,5.97 55.88,5.71 J5.5
LED1
  Top 0.203: R9.1 D1.1
LED2
  Top 0.203: D2.1 R11.1
LED3
  Top 0.203: R14.2 D3.1
LED4
  Top 0.203: D4.2(-R) 10.85,21.38 R5.1
LED5
  Top 0.203: R8.1 14.61,20.45 D4.4(-G)
LED6
  Top 0.203: R7.1 14.61,21.46 D4.3(-B)
LGT_EN
  Top 0.203: S3.6 40.89,7.11 40.39,7.62 31.5,7.62 30.99,7.11 24.26,7.11 23.75,7.62 20.45,7.62 18.67,9.4 18.67,11.68 18.03,12.32 17.14,12.32 16.51,12.95 C2.P$2 16.4,13.34 U2.5
LP_VCC
  Top 0.203: U4.A1 14.4,24.13 R6.2
  Top 0.508: J1.1 U$2.P1
  Top 0.762: R6.2 14.12,26.32 14.22,26.42
  Top 1.016: D5.P$2 14.22,26.42 JP1.1
  pour L3_PWR: 1.12,25.78 1.12,28.47 arc-90 1.5,28.85 15.24,28.85 15.24,25.78
MODULE_DC
  Top 0.203: U6.7_SDA 59.17,20.71 57.78,22.1 57.78,28.19 58.29,28.7 61.72,28.7 J4.3
MODULE_DD  (via drill 0.25 pad 0.25)
  Top 0.203: U6.8_GIO12 58.04,20.22 58.04,20.95 v57.66,21.34 | v59.94,24.51 59.94,24.64 60.58,25.27 61.59,25.27 J4.4
  Bottom 0.203: v59.94,24.51 57.66,22.23 v57.66,21.34
MRDY  (via drill 0.25)
  Top 0.203: U6.28_AD1 59.17,8.88 v58.93,8.64
  Bottom 0.203: v58.93,8.64 58.93,8.89 58.55,9.27 55.24,9.27 50.8,4.83 50.8,3.81 49.4,2.41 43.81,2.41 42.29,3.94 33.02,3.94 31.11,2.03 26.8,2.03 25.4,3.43 25.4,9.91 25.15,10.16 JP108.C
MRST  (via drill 0.25)
  Top 0.203: U6.32_IOVDD 63.12,9.95 63.12,10.92 62.87,11.18 v62.36,11.18 | v54.1,22.61 54.1,23.4 R19.2 C6.P$1 55.37,23.51
  Bottom 0.203: J4.7 59.18,28.7 58.29,28.7 54.1,24.51 v54.1,22.61 54.1,21.37 JP102.2 56.05,21.34 62.36,15.02 v62.36,11.18 61.47,10.29 R100.1 54.09,11.06 52.83,12.32 50.55,12.32 49.4,11.18 49.4,10.54 48.77,9.91 39.37,9.91 J3.12
N$1  (via drill 0.25)
  Top 0.203: v55.63,3.17 S4.4 | v62.36,24.51 62.36,23.52 R20.2
  Bottom 0.203: v55.63,3.17 55.63,4.19 58.42,6.99 60.83,6.99 63.5,9.65 63.5,17.78 63.75,18.03 63.75,23.11 v62.36,24.51
N$2  (via drill 0.25)
  Top 0.203: v54.36,3.17 S4.3 | v62.36,21.34 62.36,22.45 R21.2
  Bottom 0.203: v54.36,3.17 54.36,3.56 58.29,7.49 60.71,7.49 62.99,9.78 62.99,17.78 62.36,18.41 v62.36,21.34
N$3
  Top 0.203: S4.2 53.09,2.79 52.7,3.17 50.8,3.17 49.91,2.29 45.59,2.29 45.24,1.93 R16.2
N$4
  Top 0.203: S4.1 51.82,1.78 51.56,1.52 48.94,1.52 R17.2
N$5
  Top 0.203: U6.6_SCL 60.17,21.11 59.59,21.69 59.59,21.97 Y1.1 59.46,22.45 59.04,22.87 C7.P$2
N$6
  Top 0.203: R12.2 24.92,20.04 D6.1
N$7
  Top 0.203: R13.2 24.92,9.94 D7.1
N$8
  Top 0.203: 14.35,23.62 14.1,23.88
N$9
  Top 0.203: 14.86,23.62 15.11,23.88
N$11
  Top 0.203: R3.2 R4.2 11.15,18.51 11.62,18.99 11.81,19.18 14.86,19.18 15.51,18.53 U1.8 15.86,18.53 16.13,18.8 16.62,18.8 C3.P$1
N$14
  Top 0.203: R21.1 D9.1
N$15
  Top 0.203: R20.1 D8.1
N$16
  Top 0.203: U6.13_USBM 52.51,19.56 51.31,19.56 TP21.P$1
  Bottom 0.508: JP104.P2 50.75,20.12 TP21.P$1
N$17
  Top 0.203: U6.15_CSN 52.55,17.53 TP23.P$1
  Bottom 0.508: JP103.P2 50.75,17.83 TP23.P$1
N$18
  Top 0.203: R19.1 R18.2 52.04,24.67 50.62,26.08 S5.1
N$19
  Top 0.203: U$2.P2 4.19,26.42
  Top 0.508: 4.19,26.42 TP1.1
N$24
  Top 0.508: U$6.P2 TP5.1
N$25
  Top 0.508: U$7.P2 TP6.1
N$26
  Top 0.508: U$8.P2 TP7.1
N$27
  Top 0.508: U$9.P2 TP8.1
N$28
  Top 0.508: U$10.P2 TP9.1
N$29
  Top 0.508: U$11.P2 TP10.1
N$30
  Top 0.508: U$14.P1 TP11.1
N$31
  Top 0.508: U$15.P1 TP12.1
N$32
  Top 0.508: U$16.P1 TP13.1
N$33
  Top 0.508: U$17.P1 TP14.1
N$34
  Top 0.508: U$18.P1 TP15.1
N$35
  Top 0.508: U$19.P1 TP16.1
N$36
  Top 0.508: U$20.P1 TP17.1
N$37
  Top 0.508: U$21.P1 TP18.1
N$38
  Top 0.508: U$22.P1 TP19.1
N$39
  Top 0.508: U$23.P1 TP20.1
N$40
  Top 0.203: U6.16_SCLK 51.17,16.49 TP24.P$1
N$42
  Top 1.016: J101.2 9.65,25.77 D5.P$1
P1.0/LED1  (via drill 0.25)
  Top 0.203: v18.41,1.4 R9.2
  Top 0.508: U$3.P1 J1.2
  Bottom 0.203: v18.41,1.4 18.16,1.14 2.79,1.14 1.14,2.79 1.14,22.48 J1.2 3.81,25.15 19.81,25.15 21.08,23.88 U5.2
P1.1/RXD
  Top 0.508: J1.3 U$4.P1
  Bottom 0.203: J1.3 3.43,22.23 3.81,22.61 6.86,22.61 8.13,21.34 U5.3
P1.2/TXD
  Top 0.508: J1.4 U$5.P1
  Bottom 0.203: J1.4 3.81,20.07 7.37,20.07 7.87,19.56 20.32,19.56 21.08,18.8 U5.4
P1.3/S2
  Top 0.203: J1.5 3.81,14.99 6.86,14.99 8.26,13.59 R1.1 9.48,2.9 S2.1
  Top 0.508: U$6.P1 J1.5
  Bottom 0.203: J1.5 3.81,17.53 6.86,17.53 8.51,15.88 20.45,15.88 20.83,16.26 U5.5
P1.4/CUR/MRDY/EXT_!CS  (via drill 0.25)
  Top 0.203: v23.88,21.34 23.88,15.49 22.1,13.72 U5.6
  Top 0.508: J1.6 U$7.P1
  Bottom 0.203: J3.2 36.83,25.15 33.53,25.15 30.99,22.61 23.88,22.61 | 23.88,22.61 19.78,22.61 JP2.2 | J1.6 3.81,14.99 6.86,14.99 7.24,14.61 20.19,14.61 21.08,13.72 U5.6 23.37,13.72 24.38,12.7 JP108.2 | v23.88,21.34 23.88,22.61
P1.5/SCLK
  Top 0.203: U6.17_MOSI 49.4,15.49 48.9,14.99 39.37,14.99 J3.8 36.83,14.99 33.02,14.99 30.73,12.7 23.62,12.7 22.1,11.18 U5.7
  Top 0.508: U$8.P1 J1.7
  Bottom 0.203: J1.7 3.81,12.45 6.86,12.45 7.75,13.34 17.02,13.34 19.18,11.18 U5.7
P1.6/MISO/LED2  (via drill 0.25)
  Top 0.203: J2.4 46.99,9.91 30.99,9.91 29.72,11.18 U5.14 | U6.10_PA 56.17,18.83 v56.13,18.8 | R11.2 25.02,1.4 v27.56,3.94
  Top 0.508: J2.4 U$20.P2
  Bottom 0.203: v27.56,3.94 27.56,10.03 28.7,11.18 | 28.7,11.18 U5.14 | 28.7,11.18 27.56,12.32 27.56,14.22 28.07,14.73 30.86,14.73 31.11,14.99 39.12,14.99 39.37,15.24 39.37,17.53 J3.6 | 56.01,18.8 v56.13,18.8 51.82,14.48 50.8,14.48 49.4,13.08 49.4,12.32 J2.4
P1.6/MISO/SCL/LED1
  Top 0.203: U6.5_VBAT 61.06,20.2 61.06,21.97 Y1.2 60.94,22.45 61.48,23 C8.P$2
P1.7/MOSI  (via drill 0.25)
  Top 0.203: J3.4 36.83,20.07 32.89,20.07 30.35,17.53 28.07,17.53 27.18,16.64 27.18,15.24 28.7,13.72 U5.15 | U6.11_LNA 55.17,18.85 v55.12,18.8
  Top 0.508: U$19.P2 J2.5
  Bottom 0.203: v55.12,18.8 51.94,15.62 50.16,15.62 J2.5 46.99,12.45 30.99,12.45 29.72,13.72 U5.15
P2.0/MODULE_SS  (via drill 0.25)
  Top 0.203: v23.37,10.92 24.64,12.19 33.53,12.19 33.78,12.45 36.83,12.45 J3.10 39.37,12.45 48.77,12.45 50.82,14.49 U6.18_MISO
  Top 0.508: U$9.P1 J1.8
  Bottom 0.203: J1.8 3.81,7.37 6.1,7.37 9.78,3.68 17.91,3.68 19.94,5.71 19.94,7.49 21.08,8.64 U5.8 23.37,8.64 | 23.37,8.64 24.31,8.64 JP108.1 | v23.37,10.92 23.37,8.64
P2.1/LED4
  Top 0.203: J1.9 1.14,7.49 1.14,21.84 1.91,22.61 6.86,22.61 8.99,20.48 R5.2
  Top 0.508: U$10.P1 J1.9
  Bottom 0.203: J1.9 3.81,4.83 6.86,4.83 8.51,3.17 18.16,3.17 21.08,6.1 U5.9
P2.2/SRDY
  Top 0.508: U$11.P1 J1.10
  Bottom 0.203: J1.10 3.81,2.29 6.86,2.29 7.24,2.67 20.19,2.67 21.08,3.56 U5.10 22.1,3.56 24.13,1.52 31.62,1.52 32.38,2.29 JP105.2
P2.3/SDA  (via drill 0.25)
  Top 0.203: v42.8,4.83 46.99,4.83 J2.1
  Top 0.508: U$23.P2 J2.1
  Bottom 0.203: JP106.1 v42.8,4.83
P2.4/SCL/LED3
  Top 0.508: U$22.P2 J2.2
  Bottom 0.203: J2.2 46.99,4.83 43.73,4.83 JP107.1
P2.5/LED5
  Top 0.203: J2.3 46.99,7.37 43.18,7.37 41.91,8.64 U5.13 24.77,8.64 23.24,10.16 20.57,10.16 19.68,11.05 19.68,18.29 17.53,20.45 R8.2
  Top 0.508: U$21.P2 J2.3
  Bottom 0.203: R100.2 49.91,10.29 J2.3
P2.6/LED6
  Top 0.203: J2.9 46.99,25.15 43.18,25.15 41.91,26.42 32.26,26.42 29.72,23.88 U5.19 28.7,23.88 27.43,22.61 19.81,22.61 18.67,21.46 R7.2
  Top 0.508: U$15.P2 J2.9
P2.7/MRST
  Top 0.203: J2.8 46.99,22.61 43.18,22.61 40.64,25.15 33.53,25.15 29.72,21.34 U5.18
  Top 0.508: U$16.P2 J2.8
  Bottom 0.203: JP102.1 J2.8
RST/S1  (via drill 0.25)
  Top 0.203: J2.6 48.26,16.38 47.12,17.53 33.78,17.53 32.51,16.26 31.62,16.26 | v32.13,4.19 32.13,2.62 S1.1 | U5.16 31.62,16.26 | R15.1 31.62,16.26 | 31.62,16.26 C5.P$1
  Top 0.508: U$18.P2 J2.6
  Bottom 0.203: v32.13,4.19 30.48,2.54 27.18,2.54 26.16,3.56 26.16,14.61 27.81,16.26 U5.16
SCL  (via drill 0.25)
  Top 0.203: U5.12 24.26,6.1 23.24,7.11 20.32,7.11 18.16,9.27 18.16,11.43 17.91,11.68 v14.1,11.68 14.1,14.35 | U3.B3 v14.1,9.02 | D3.2 27.87,1.84 28.57,2.54 30.48,2.54 31.24,3.3 31.24,4.32 32.89,5.97 v33.15,5.97 | 14.1,14.35 14.1,15.49 14.48,15.88 17.78,15.88 | U1.6 16.12,17.53 16.38,17.27 v16.64,17.27 17.14,17.27 17.78,16.64 17.78,15.88 | U2.1 14.03,14.29 14.1,14.35 | R10.2 17.78,15.88
  Top 0.508: U$4.P2 TP3.1
  Bottom 0.203: JP104.P1 49.71,19.51 49.15,20.07 43.18,20.07 40.64,22.61 34.54,22.61 34.04,22.1 34.04,18.8 | v14.1,9.02 v14.1,11.68 | 34.04,18.8 31.62,18.8 30.61,17.78 23.88,17.78 | 34.04,18.8 J3.5 | 23.88,17.78 17.14,17.78 v16.64,17.27 | TP3.1 6.86,21.34 8.13,20.07 22.86,20.07 23.88,19.05 23.88,17.78 | JP107.2 34.54,7.37 v33.15,5.97 29.34,5.97 U5.12
SDA  (via drill 0.25)
  Top 0.203: U3.C3 v15.49,9.02 | 16.38,16.51 v16.64,16.51 15.62,16.51 15.6,16.53 | U2.3 12,12.38 v11.94,12.32 11.3,12.95 11.3,14.29 11.28,14.32 | U1.5 15.6,16.53 | R2.2 11.28,14.32 | 11.28,14.32 13.46,16.51 15.57,16.51 15.6,16.53
  Top 0.508: U$5.P2 TP4.1
  Bottom 0.203: 4.45,18.8 TP4.1 6.86,18.8 8.51,17.14 15.24,17.14 15.88,16.51 v16.64,16.51 17.27,16.51 18.03,17.27 30.35,17.27 30.99,16.64 30.99,16.26 | v15.49,9.02 15.49,11.68 14.86,12.32 v11.94,12.32 | JP103.P1 49.71,17.22 49.4,17.53 43.18,17.53 40.64,20.07 37.08,20.07 36.83,19.81 36.83,17.53 J3.7 30.99,16.26 | 30.99,16.26 30.99,15.62 30.61,15.24 27.69,15.24 26.92,14.48 26.92,3.68 27.3,3.3 28.96,3.3 U5.11 29.72,3.56 30.99,4.83 JP106.2
SRDY  (via drill 0.25)
  Top 0.203: U6.27_AD0 v58.17,8.64
  Bottom 0.203: 58.17,8 52.07,1.91 43.69,1.91 43.31,2.29 JP105.1 | J3.11 38.1,8.64 41.91,8.64 43.18,7.37 52.7,7.37 55.12,9.78 58.93,9.78 59.56,9.14 59.56,8.38 59.18,8 58.17,8 | 58.17,8 v58.17,8.64
STLRS_GND
  Top 0.508: U$3.P2 TP2.1
TEMP/ROM_EN  (via drill 0.25)
  Top 0.203: S3.7 39.62,6.86 39.37,7.11 32.51,7.11 30.48,5.08 26.92,5.08 26.67,4.83 19.18,4.83 18.03,3.68 10.16,3.68 8.76,5.08 8.76,9.27 | C1.P$2 9.64,9.27 8.76,9.27 | 8.76,9.27 8.76,16 9.4,16.64 R3.1
  Top 0.254: U3.A3 v12.7,9.02 | v9.65,10.16 C1.P$2
  Bottom 0.254: v12.7,9.02 10.16,9.02 9.65,9.53 v9.65,10.16
TEST
  Top 0.203: J2.7 46.99,20.07 43.18,20.07 40.64,22.61 33.53,22.61 29.72,18.8 U5.17
  Top 0.508: U$17.P2 J2.7
TP_EN
  Top 0.203: U6.19_GIO1 51.15,13.49 TP25.P$1
TP_HGM
  Top 0.203: U6.24_MCLK 55.17,8.71 TP27.P$1
TP_P02
  Top 0.203: U6.29_GIO9/AD2 60.17,8.54 TP29.P$1
TP_P05
  Top 0.203: U6.26_WCLK 57.17,8.4 TP28.P$1
TP_PAEN
  Top 0.203: U6.21_GIO3 51.12,11.49 TP26.P$1
VDD  (via drill 0.25, 0.25 pad 0.25)
  Top 0.203: v32.38,17.78 31.65,17.78 R15.2 | R1.2 7.4,1.94 v7.24,1.78 | R2.1 v10.41,12.32 | C4.P$1 21.98,26.81 U5.1 | R10.1 18.44,13.36 v18.54,13.46 | R12.1 v26.92,18.8 | R13.1 v27.56,11.18 | R18.1 v50.16,23.5 | R4.1 v9.27,17.91
  Top 0.254: S3.2 S3.3 S3.4 v42.16,3.17
  L3_PWR 0.635: U5.1 21.59,25.15
  Bottom 0.203: JP101.1 58.04,15.95 v58.04,14.99 58.04,14.02 JP100.2
  Bottom 0.254: J4.2 62.87,25.27 59.05,25.27 v56.26,22.48
  pour L3_PWR (rank 2): 10.16,1.12 1.5,1.12 arc-90 1.12,1.5 1.12,28.47 arc-90 1.5,28.85 64.97,28.85 arc-90 65.35,28.47 65.35,1.5 arc-90 64.97,1.12 10.19,1.12 10.19,3.68 18.03,3.68 18.03,11.56 10.16,11.56
VDD_RADIO  (via drill 0.25 pad 0.25)
  Top 0.203: C9.P$1 C10.P$1 64.43,9.11 64.17,9.36 U6.33_VDD | U4.A2 14.8,24.13 R6.1
  Top 0.559: v64.19,11.18 64.19,9.92 U6.33_VDD
  Top 0.762: R6.1 15.09,24.36 15.62,24.89 17.21,24.89 JP1.3
  pour L3_PWR: 18.21,28.85 64.97,28.85 arc-90 65.35,28.47 65.35,10.92 63.5,10.92 63.25,11.18 63.25,16.51 53.98,25.78 18.21,25.78

### Text on the board
tPlace: J1 | 1 | C | 2 | J2 | GND | VCC | GND | P2.6 | AIR MODULE | RESET | POWER | P1.0 | CSNX | VDD | P2.7 | P1.1 | RGB | LED | SCL | MOSI | TEST | P1.2 | MISO | SDA | RST | EEPROM | P1.3 | GND | SCLK | P1.7 | P1.4 | RGB | CSNR | SENSOR | SRDY | P1.6 | P1.5 | MRST | P2.5 | SENS | P2.0 | SENSOR | GPIO | D1/2 | TEMP | RGB | D3/4 | P2.4 | 0 | 1 | 2 | 3 | IO 3 | IO 1 | GND | TEMP | P2.1 | MCU | P2.3 | IR | RESET | P2.2 | IO 2 | IO 0 | VDD
bPlace: J1 | 66931-0003 | J2 | VCC | GND | P1.0 | CSNX | GND | P2.6 | P1.1 | MOSI | EXT PWR | VDD | P1.2 | (+) | (-) | MISO | P2.7 | SCL | TEST | P1.3 | SCLK | 2 | C | 1 | RST | P1.4 | SDA | CSNR | EN | DEVICE | GND | P1.7 | PAEN | ESD SENSITIVE | P1.5 | MRST | 1 | C | 2 | P2.0 | SRDY | P1.6 | P2.5 | P2.1 | IO 3 | IO 1 | GND | HGM | P2.2 | P2.4 | P2.3 | IO 2 | IO 0 | VDD
DrillLegend: LAYER-STACK
DrillLegend_01-02: 01-16